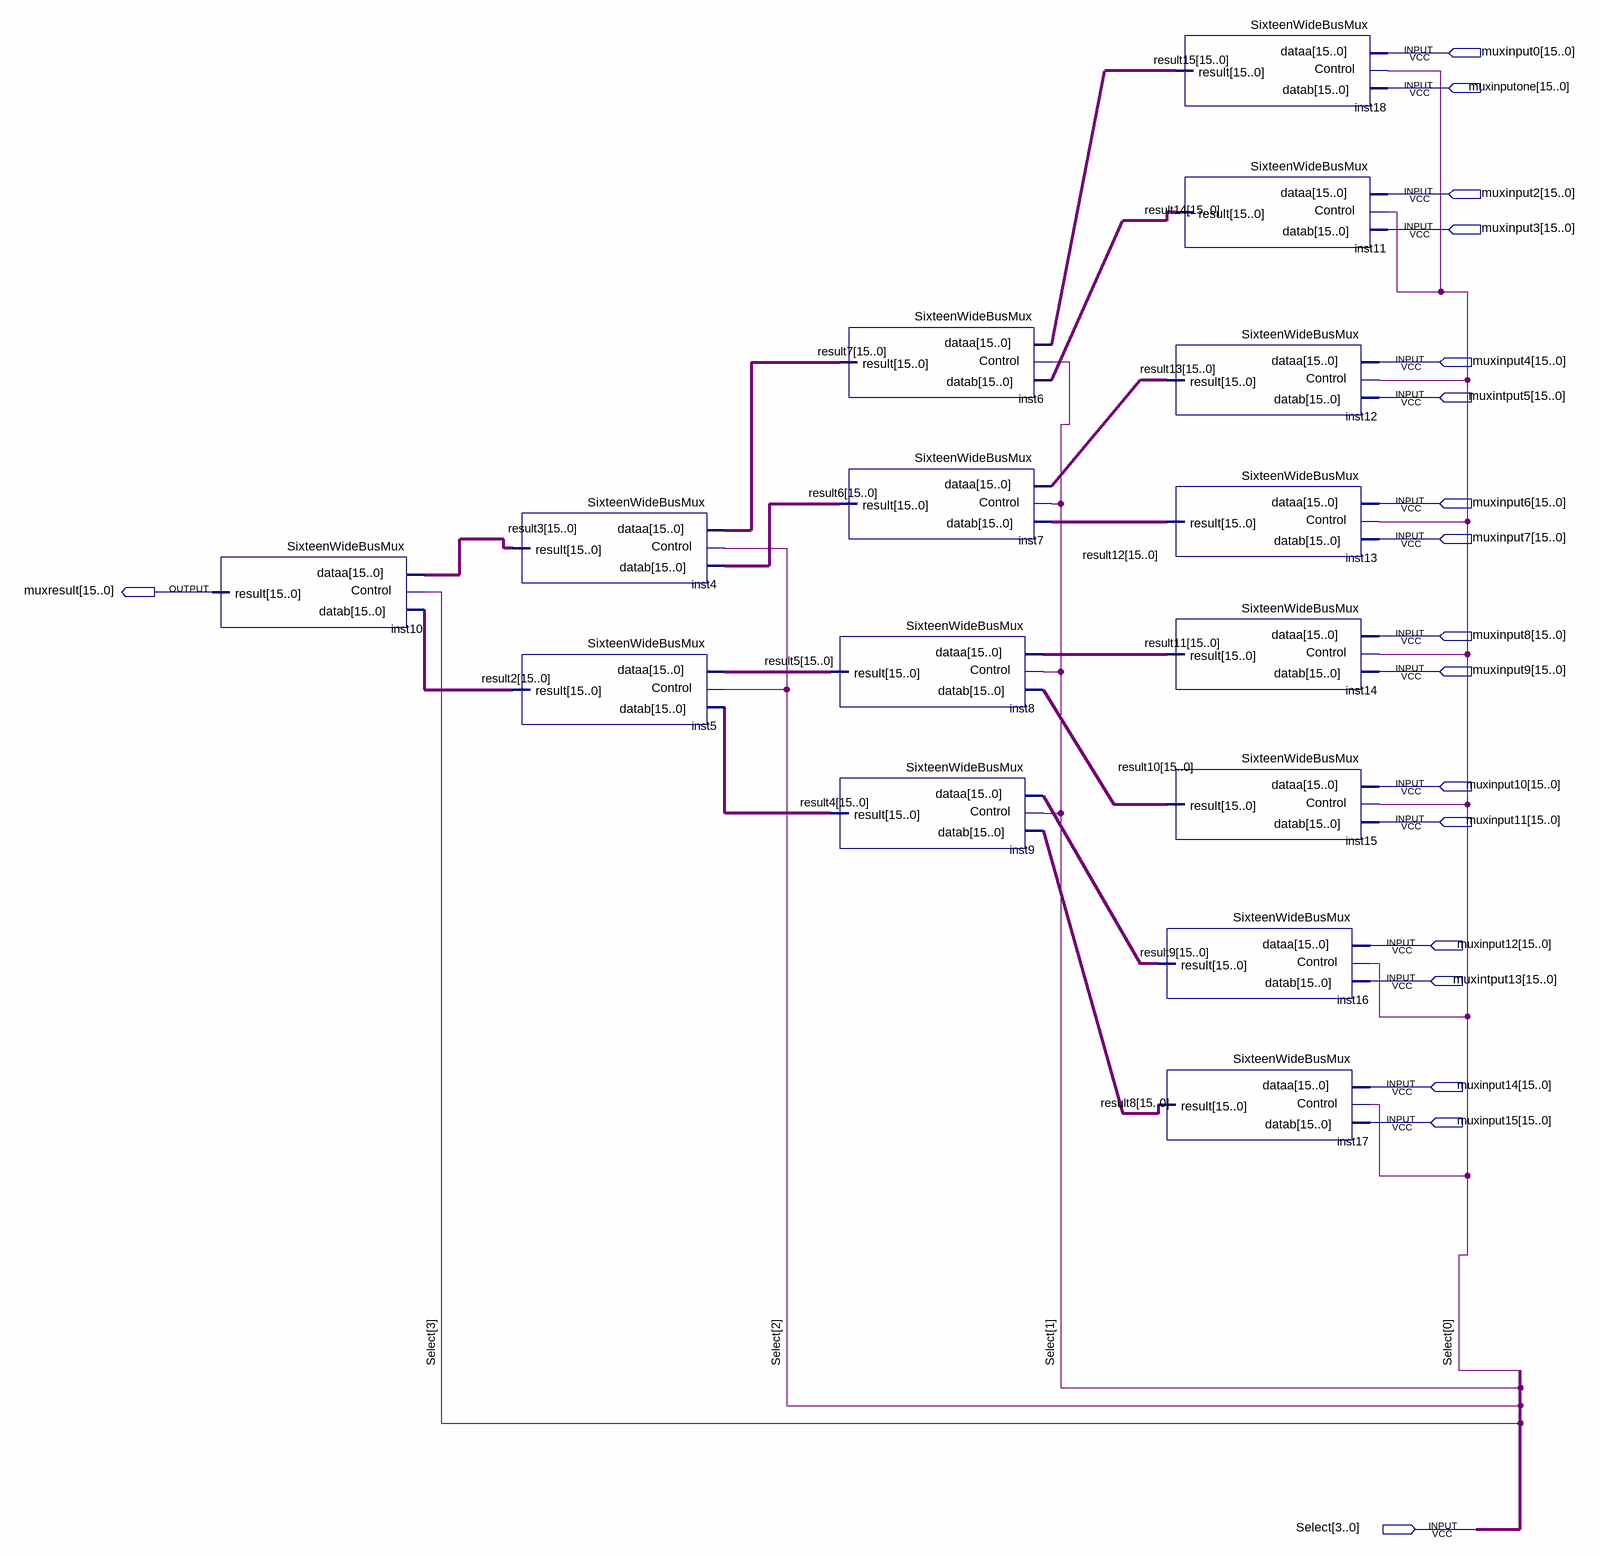
[diagram p0: schematic sheet]
// Quartus schematic C16to1BusMUX.bdf as structural Verilog: 15 symbols, 18 pins
module C16to1BusMUX (
  input  [15:0] muxinput0,
  input  [15:0] muxinputone,
  input  [15:0] muxinput2,
  input  [15:0] muxinput3,
  input  [15:0] muxinput4,
  input  [15:0] muxintput5,
  input  [15:0] muxinput6,
  input  [15:0] muxinput7,
  input  [15:0] muxinput8,
  input  [15:0] muxinput9,
  input  [15:0] muxinput10,
  input  [15:0] muxinput11,
  input  [15:0] muxinput12,
  input  [15:0] muxintput13,
  input  [15:0] muxinput14,
  input  [15:0] muxinput15,
  input  [3:0] Select,
  output [15:0] muxresult
);

  wire [15:0] result2, result3, result4, result5, result6, result7, result8, result9, result10, result11,
       result12, result13, result14, result15;

  SixteenWideBusMux inst10 (.Control(Select[3]), .dataa(result3), .datab(result2), .result(muxresult));
  SixteenWideBusMux inst4 (.Control(Select[2]), .dataa(result7), .datab(result6), .result(result3));
  SixteenWideBusMux inst5 (.Control(Select[2]), .dataa(result5), .datab(result4), .result(result2));
  SixteenWideBusMux inst6 (.Control(Select[1]), .dataa(result15), .datab(result14), .result(result7));
  SixteenWideBusMux inst7 (.Control(Select[1]), .dataa(result13), .datab(result12), .result(result6));
  SixteenWideBusMux inst8 (.Control(Select[1]), .dataa(result11), .datab(result10), .result(result5));
  SixteenWideBusMux inst9 (.Control(Select[1]), .dataa(result9), .datab(result8), .result(result4));
  SixteenWideBusMux inst18 (.Control(Select[0]), .dataa(muxinput0), .datab(muxinputone), .result(result15));
  SixteenWideBusMux inst11 (.Control(Select[0]), .dataa(muxinput2), .datab(muxinput3), .result(result14));
  SixteenWideBusMux inst12 (.Control(Select[0]), .dataa(muxinput4), .datab(muxintput5), .result(result13));
  SixteenWideBusMux inst13 (.Control(Select[0]), .dataa(muxinput6), .datab(muxinput7), .result(result12));
  SixteenWideBusMux inst14 (.Control(Select[0]), .dataa(muxinput8), .datab(muxinput9), .result(result11));
  SixteenWideBusMux inst15 (.Control(Select[0]), .dataa(muxinput10), .datab(muxinput11), .result(result10));
  SixteenWideBusMux inst16 (.Control(Select[0]), .dataa(muxinput12), .datab(muxintput13), .result(result9));
  SixteenWideBusMux inst17 (.Control(Select[0]), .dataa(muxinput14), .datab(muxinput15), .result(result8));
endmodule
